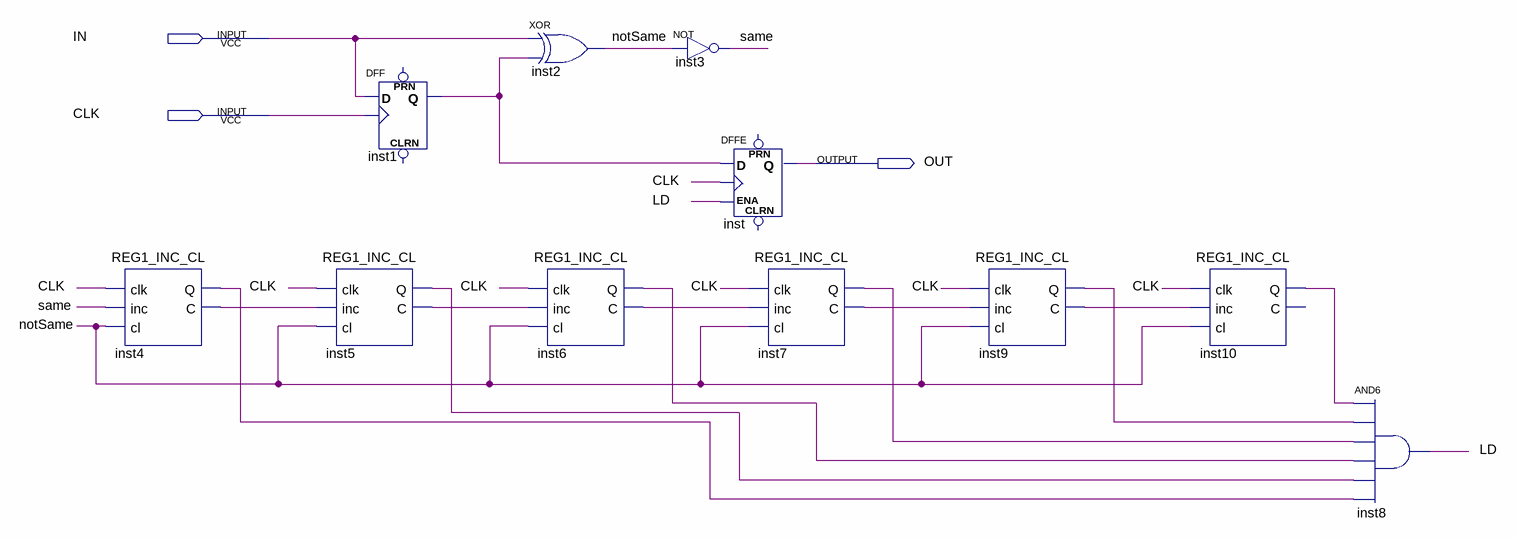
[diagram p0: schematic sheet]
// Quartus schematic Debounce.bdf as structural Verilog: 11 symbols, 3 pins
module Debounce (
  input  IN,
  input  CLK,
  output OUT
);

  wire inst1_q, inst4_c, inst4_q, inst5_c, inst5_q, inst6_c, inst6_q, inst7_c, inst7_q, inst9_c, inst9_q,
       inst10_q, LD, notSame, same;

  REG1_INC_CL inst4 (.clk(CLK), .inc(same), .cl(notSame), .Q(inst4_q), .C(inst4_c));
  DFF inst1 (.CLK(CLK), .D(IN), .Q(inst1_q));  // open: CLRN, PRN
  REG1_INC_CL inst5 (.clk(CLK), .inc(inst4_c), .cl(notSame), .Q(inst5_q), .C(inst5_c));
  xor inst2 (notSame, IN, inst1_q);
  REG1_INC_CL inst6 (.clk(CLK), .inc(inst5_c), .cl(notSame), .Q(inst6_q), .C(inst6_c));
  not inst3 (same, notSame);
  DFFE inst (.D(inst1_q), .CLK(CLK), .ENA(LD), .Q(OUT));  // open: PRN, CLRN
  REG1_INC_CL inst7 (.clk(CLK), .inc(inst6_c), .cl(notSame), .Q(inst7_q), .C(inst7_c));
  REG1_INC_CL inst9 (.clk(CLK), .inc(inst7_c), .cl(notSame), .Q(inst9_q), .C(inst9_c));
  REG1_INC_CL inst10 (.clk(CLK), .inc(inst9_c), .cl(notSame), .Q(inst10_q));  // open: C
  and inst8 (LD, inst10_q, inst9_q, inst7_q, inst6_q, inst5_q, inst4_q);
endmodule
